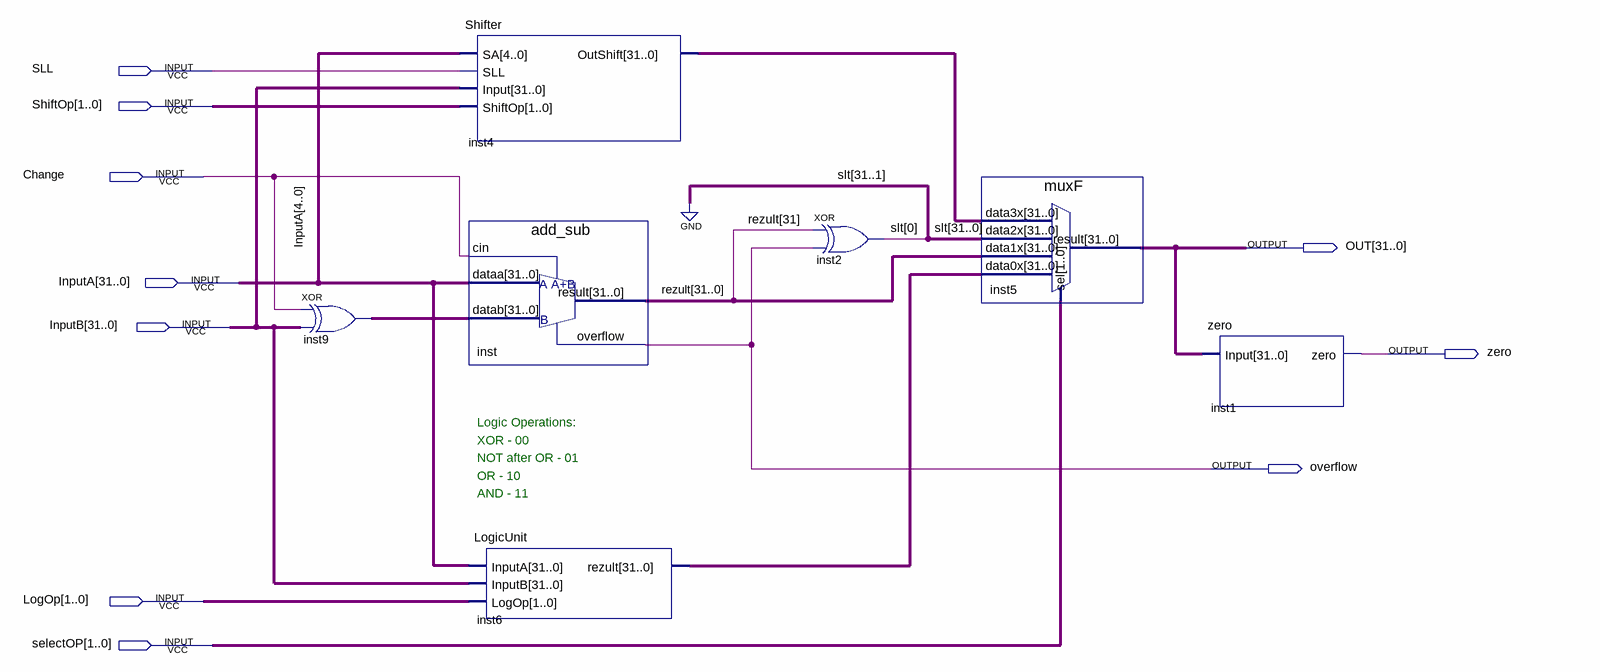
[diagram p0: schematic sheet]
// Quartus schematic Lab2_2.bdf as structural Verilog: 7 symbols, 10 pins
module Lab2_2 (
  input  SLL,
  input  [1:0] ShiftOp,
  input  Change,
  input  [31:0] InputA,
  input  [31:0] InputB,
  input  [1:0] LogOp,
  input  [1:0] selectOP,
  output [31:0] OUT,
  output zero,
  output overflow
);

  wire [0:0] slt;
  wire [31:0] inst4_outshift, inst6_rezult, inst9_out, rezult;

  assign inst9_out = {32{Change}} ^ InputB;  // XOR inst9, 32 bits wide
  Shifter inst4 (.SA(InputA[4:0]), .SLL(SLL), .Input(InputB), .ShiftOp(ShiftOp), .OutShift(inst4_outshift));
  add_sub inst (.cin(Change), .dataa(InputA), .datab(inst9_out), .result(rezult), .overflow(overflow));
  LogicUnit inst6 (.InputA(InputA), .InputB(InputB), .LogOp(LogOp), .rezult(inst6_rezult));
  xor inst2 (slt[0], rezult[31], overflow);
  muxF inst5 (
    .data3x(inst4_outshift), .data2x({{31{1'b0}}, slt[0]}), .data1x(rezult), .data0x(inst6_rezult),
    .sel(selectOP), .result(OUT));
  zero inst1 (.Input(OUT), .zero(zero));

  // Notes on the sheet:
  //   Logic Operations:
  //   XOR - 00
  //   NOT after OR - 01
  //   OR - 10
  //   AND - 11
endmodule
